# EAGLE design utilidong-septic-sepic-lt1610-mk-1.1 (EAGLE 6.5.0)
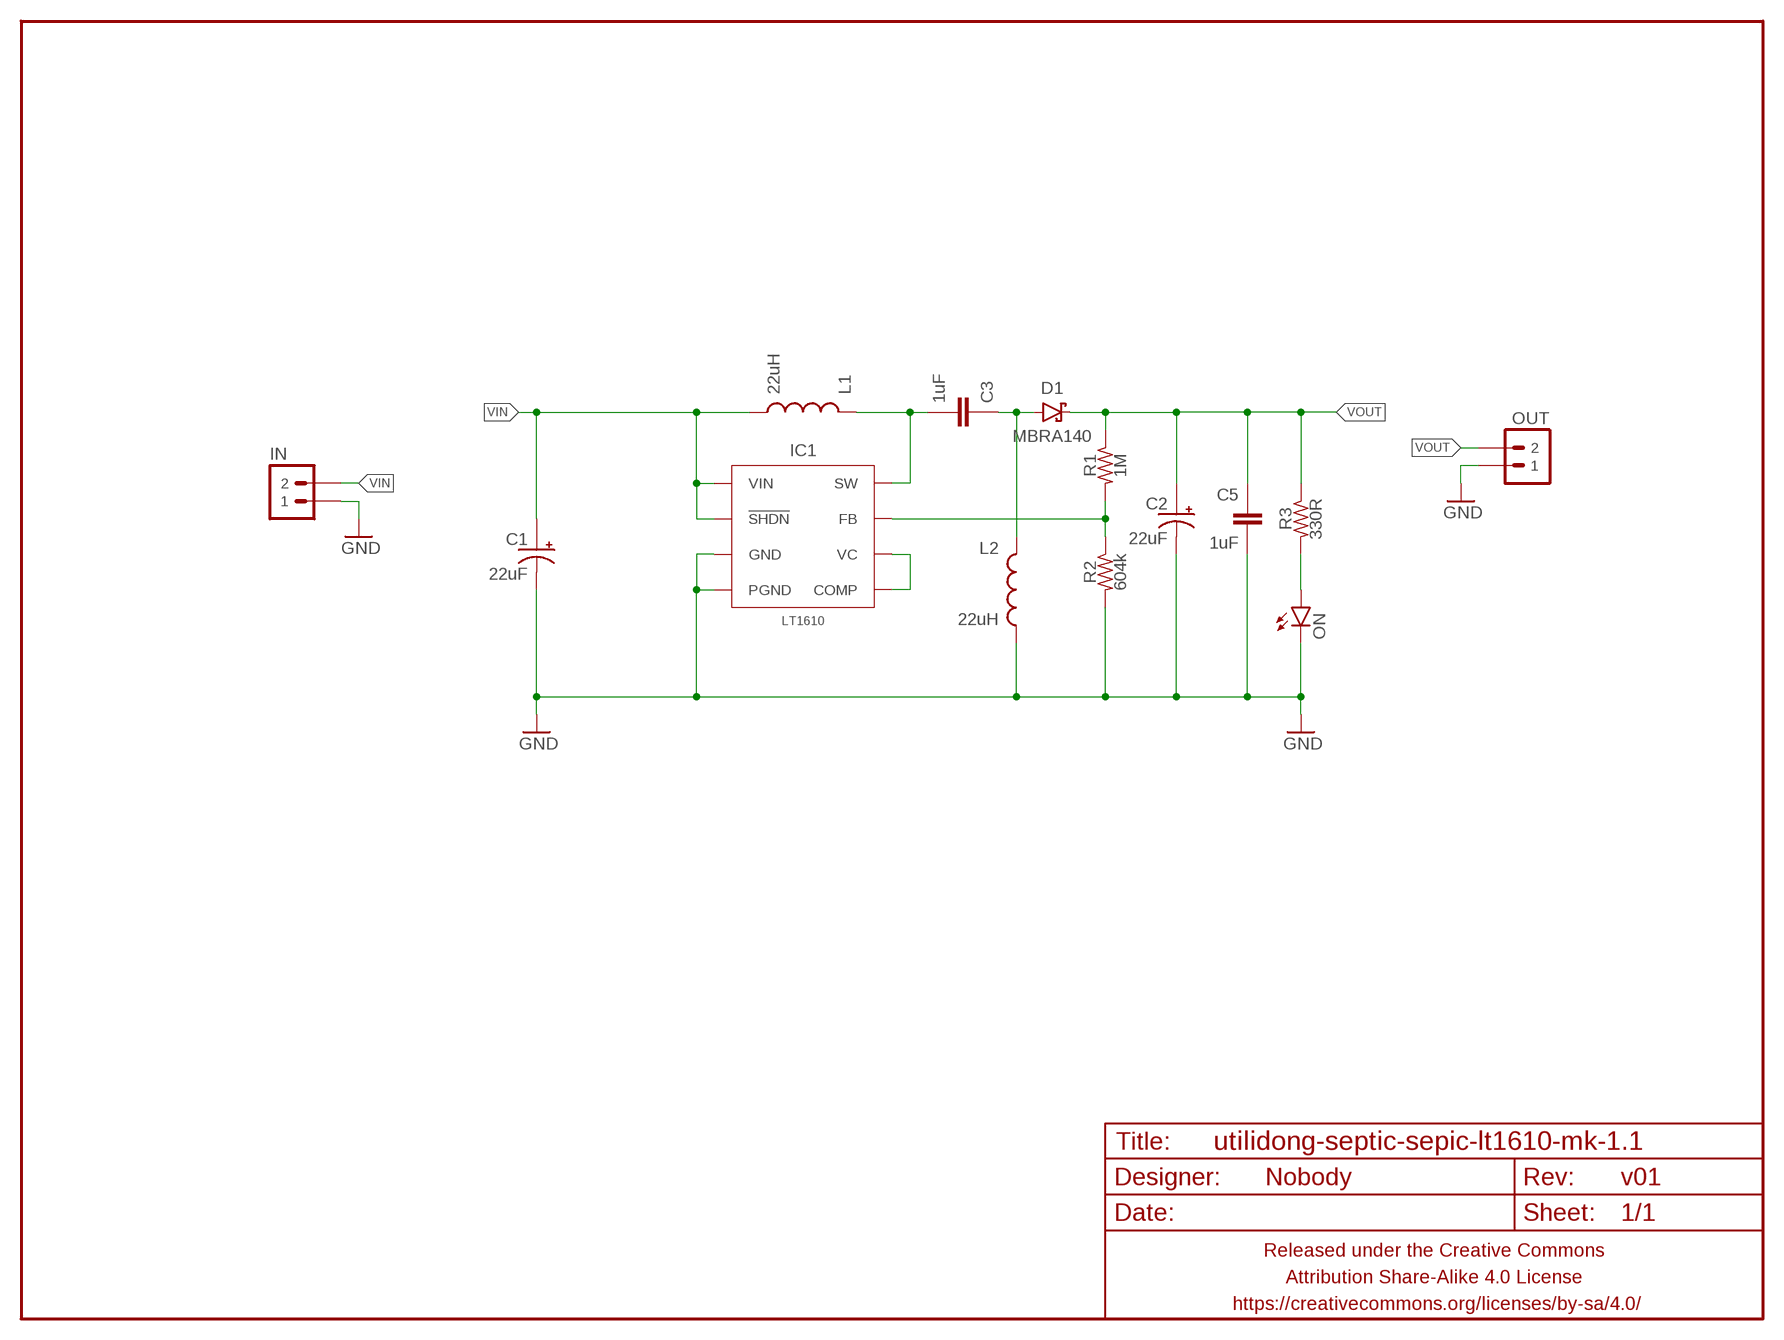
[diagram p0: schematic, sheet 1]

## Parts
C1  22uF  CAPACITOR-POLARIZEDE2.5-6  [E2,5-6]
C2  22uF  CAPACITOR-POLARIZEDE2.5-6  [E2,5-6]
C3  1uF  CAPACITOR-CERAMICC0805  [C0805]
C5  1uF  CAPACITOR-CERAMICC0805  [C0805]
D1  MBRA140  DIODE-SCHOTTKYMBRA140  [SMA-DIODE]
FRAME1  FRAME-LETTERNO_PACKAGE  [DUMMY]
IC1  LT1610  LT1610SOICN8  [SO08]
IN  M02PTH-CENTERED-R+  [1X02-CENTER-R+]
L1  22uH  INDUCTORMURATA-1100R  [MURATA-1100R]
L2  22uH  INDUCTORMURATA-1100R  [MURATA-1100R]
ON  LED3MM-LESS  [LED3MM-LESSSILK]
OUT  M02PTH-CENTERED-R+  [1X02-CENTER-R+]
R1  1M  RESISTORR0805  [R0805]
R2  604k  RESISTORR0805  [R0805]
R3  330R  RESISTORR0805  [R0805]

## Nets
GND: C1.- C2.- C5.2 IC1.4(PGND) IC1.7(GND) IN.1 L2.P$2 ON.K(C) OUT.1 R2.2
N$1: ON.A R3.2
N$2: C3.2 IC1.5(SW) L1.P$1
N$4: IC1.1(VC) IC1.8(COMP)
N$5: C3.1 D1.A L2.P$1
N$7: IC1.2(FB) R1.2 R2.1
VIN: C1.+ IC1.3(!SHDN) IC1.6(VIN) IN.2 L1.P$2
VOUT: C2.+ C5.1 D1.C OUT.2 R1.1 R3.1

## Library data of the parts
C1 C2 = A_butts:CAPACITOR-POLARIZED: POLARIZED CAPACITOR, American symbol
C3 C5 = A_butts:CAPACITOR-CERAMIC: CAPACITOR, European symbol
D1 = A_butts:DIODE-SCHOTTKY: Schottky diodes in SFE's production catalog BAT20J 1A 23V 0.62Vf RB751 120mA 40V 0.37Vf PMEG4005EJ 0.5A 40V 0.42Vf MBRA140 1A 40V 0.5Vf B340A 3A 40V SMA; PROD_ID: DIO-08053
FRAME1 = A_butts:FRAME-LETTER: Schematic Frame Standard 8.5x11 US Letter frame; DESIGNER: Nobody; VERSION: v01
IC1 = A_butts:LT1610
IN OUT = A_butts:M02: Standard 2-pin 0.1" header. Use with - straight break away headers ( PRT-00116) - right angle break away headers (PRT-00553) - swiss pins (PRT-00743) - machine pins (PRT-00117) - female headers (PRT-00115) Molex polarized connector foot print use with: PRT-08233 with associated crimp pins and housings. 2.54_SCREWTERM for use with PRT-10571. 3.5mm Screw Terminal footprints for PRT-08084 5mm Screw Terminal footprints for use with PRT-08433
L1 L2 = A_butts:INDUCTOR: Inductors Basic Inductor/Choke - 0603 and 1206. Footprints are not proven and vary greatly between part numbers. SRN6045- 33uH, 20% 1.4A SDR0403-560KL - 56uH, 10%, 500mA RMS/740mA peak
ON = A_butts:LED: LEDs Standard schematic elements and footprints for 5mm, 3mm, 1206, and 0603 sized LEDs. 5mm - Spark Fun Electronics SKU : COM-00529 (and others)
R1-R3 = A_butts:RESISTOR: RESISTOR, American symbol

## Board
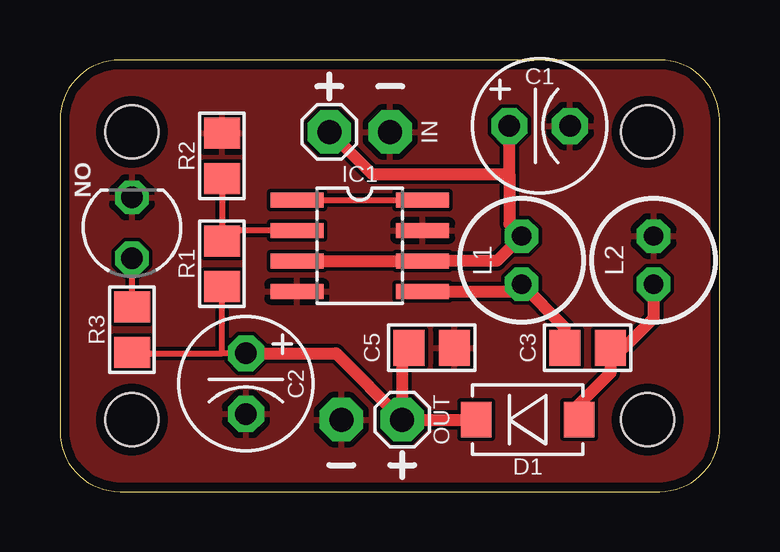
[diagram p1: board, top side]
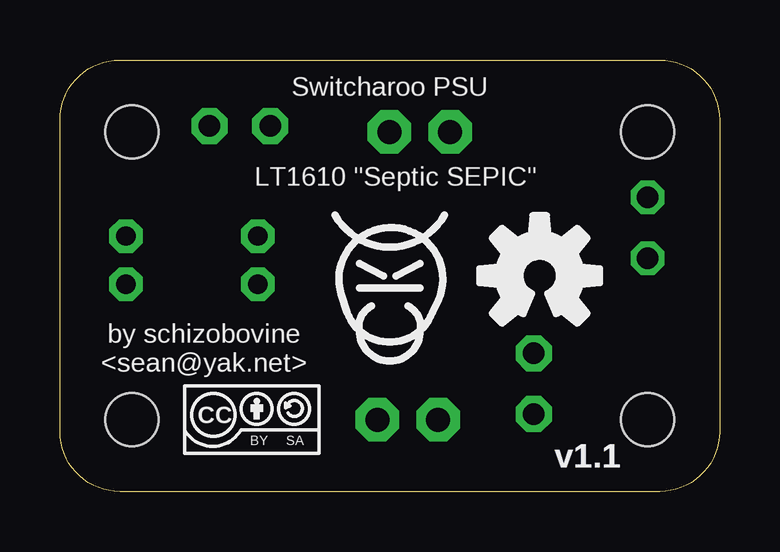
[diagram p2: board, bottom side, seen from below]

Size 27.5 x 18 mm. Coordinates in mm from the lower left corner, seen from the top.
Outline: 0,15.5 0,2.5 arc90 2.5,0 25,0 arc90 27.5,2.5 27.5,15.5 arc90 25,18 2.5,18 arc90 0,15.5
Copper layers (1*16): Top 0.0356mm / dielectric 1.5011mm / Bottom 0.0356mm
Design rules "LaenPCBOrder_2": minimum track width 6mil, minimum drill 13mil, track to track 6mil, track to pad 6mil, pad to pad 6mil, via to via 6mil, smd to smd 6mil, copper to edge 15mil, drill to drill 6mil, minimum pad ring 7mil, minimum via ring 7mil, stop-mask expansion 3mil, vias tented up to drill 20mil, thermal gap 10mil
Holes 2.2 mm at 3,3 3,15 24.5,15 24.5,3

### Footprints (pad centres in the part's own frame; a part is rotated, then mirrored left to right if it is on the bottom)
E2,5-6 = drill 0.9 pad 1.5 octagon: + -1.27,0; - 1.27,0
C0805 = smd 1.3 x 1.5: 1 -0.95,0; 2 0.95,0
SMA-DIODE = smd 1.27 x 1.47: A -2.15,0; C 2.15,0
SO08 = smd 0.61 x 2.21: 1 -1.905,-2.616; 2 -0.635,-2.616; 3 0.635,-2.616; 4 1.905,-2.616; 5 1.905,2.616; 6 0.635,2.616; 7 -0.635,2.616; 8 -1.905,2.616
1X02-CENTER-R+ = drill 1 pad 1.8 octagon: 1 -1.27,0; 2 1.27,0
MURATA-1100R = drill 0.8 pad 1.4 octagon: P$1 -1,0; P$2 1,0
LED3MM-LESSSILK = drill 0.9 pad 1.4 octagon: A -1.27,0; K 1.27,0
R0805 = smd 1.3 x 1.5: 1 -0.95,0; 2 0.95,0

### Placement (x,y rotation side)
C1  20,15.25 0 top
C2  7.75,4.5 270 top
C3  22,6 180 top
C5  15.5,6 0 top
D1  19.5,3 180 top
FRAME1  0,0 0 top
IC1  12.5,10.25 270 top
IN  12.5,15 180 top
L1  19.25,9.65 90 top
L2  24.75,9.65 90 top
ON  3,11 90 top
OUT  13,3 0 top
R1  6.75,9.5 90 top
R2  6.75,14 90 top
R3  3,6.75 90 top
U$1  [CC-BY-SA-4.0-NO-URL]  19.5,3 0 bottom
U$2  [COW_SMALL_METAL_NOTEXT]  13.75,9 0 bottom
U$3  [OSHWLOGO_TOP_0.2_A]  7.5,9 0 bottom

### Tracks (layer width: path | path; a pad name or v marks a point on that pad's centre or on a via)
GND
  pour Top: -0.1,-0.1 -0.1,18.1 27.6,18.1 27.6,-0.1
N$1
  Top 0.25: R3.2 ON.A
N$2
  Top 0.5: IC1.5 18.95,8.35 L1.P$1 21.05,6.85 C3.2
N$4
  Top 0.25: IC1.1 IC1.8
N$5
  Top 0.5: L2.P$1 24.75,7.25 23.5,6 C3.1 22.95,4.95 21.65,3.65 D1.A
N$7
  Top 0.25: R2.1 R1.2 6.75,10.88 IC1.2
VIN
  Top 0.5: IN.2 11.25,15 13,13.25 18.73,13.25 | IC1.3 IC1.6 18.21,9.62 L1.P$2 18.73,11.17 18.73,13.25 | 18.73,13.25 C1.+
VOUT
  Top 0.25: 3.03,5.77 6.75,5.77 | 6.75,5.77 R1.1 | C2.+ 6.75,5.77
  Top 0.5: OUT.2 D1.C | R3.1 3.03,5.77 | C2.+ 11.5,5.77 OUT.2 | C5.1 14.27,5.72 OUT.2

### Text on the board
bPlace: Switcharoo PSU | LT1610 "Septic SEPIC" | by schizobovine / <sean@yak.net>